# EAGLE design MCP73837_LiPo_Charger (EAGLE 9.6.2)
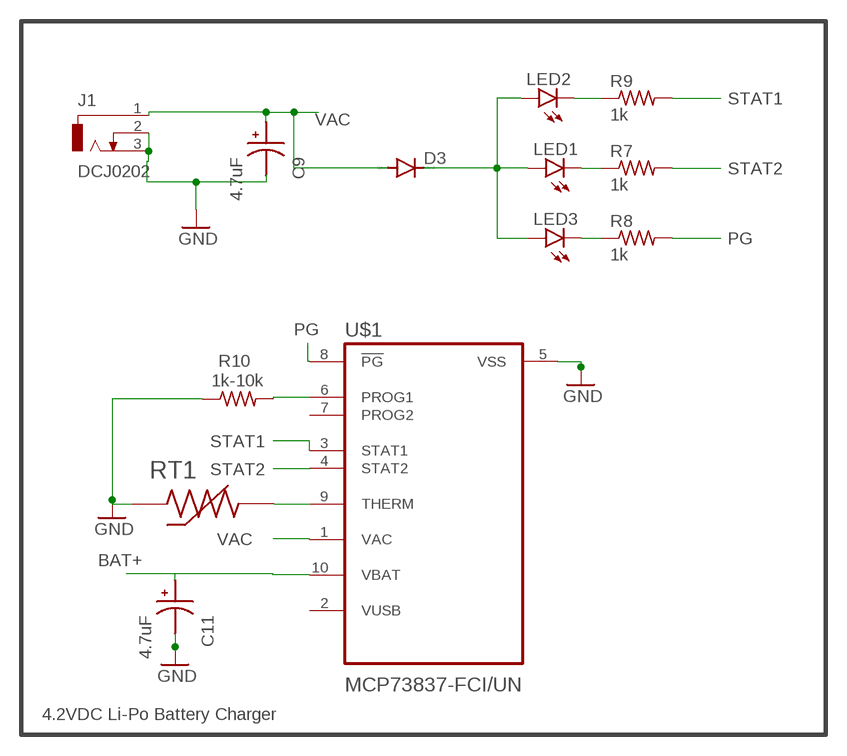
[diagram p0: schematic, sheet 1]

## Parts
C9  4.7uF  EEE-1CA100SR  [CAPAE430X550N]
C11  4.7uF  EEE-1CA100SR  [CAPAE430X550N]
D3  DIODE-DO214BA  [DO214BA]
J1  DCJ0202  [DCJ0202]
LED1  LEDCHIP-LED0805  [CHIP-LED0805]
LED2  LEDCHIP-LED0805  [CHIP-LED0805]
LED3  LEDCHIP-LED0805  [CHIP-LED0805]
R7  1k  RP73PF2A10KBTDF  [RESC2012X65N]
R8  1k  RP73PF2A10KBTDF  [RESC2012X65N]
R9  1k  RP73PF2A10KBTDF  [RESC2012X65N]
R10  1k-10k  RP73PF2A10KBTDF  [RESC2012X65N]
RT1  NCP18XW223E03RB  [THRMC1608X95N]
U$1  MCP73837-FCI/UN  [SOP50P490X110-10N]

## Nets
BAT+: C11.1 U$1.10(VBAT)
GND: C9.2 C11.2 J1.2 J1.3 R10.1 RT1.1 U$1.5(VSS)
N$18: D3.C LED1.A LED2.A LED3.A
N$19: LED2.C R9.1
N$20: LED1.C R7.1
N$21: LED3.C R8.1
N$23: R10.2 U$1.6(PROG1)
N$24: RT1.2 U$1.9(THERM)
PG: R8.2 U$1.8(!PG)
STAT1: R9.2 U$1.3(STAT1)
STAT2: R7.2 U$1.4(STAT2)
VAC: C9.1 D3.A J1.1 U$1.1(VAC)
Unconnected: U$1.2(VUSB) U$1.7(PROG2)

## Notes on the sheet
- 4.2VDC Li-Po Battery Charger

## Library data of the parts
C9 C11 = EEE-1CA100SR_10uF_SMD:EEE-1CA100SR: Capacitor Alum Elec, 10uf, 16v, 20%, Scapacitor Alum Elec, 10uf, 16v, 20%, Smd, Full Reel Check prices <https://pricing.snapeda.com/search/part/EEE-1CA100SR/?ref=eda>; AVAILABILITY: Warning; DESCRIPTION: 10µF 16V Aluminum Electrolytic Capacitors Radial, Can - SMD 2000 Hrs @ 85°C; MF: Panasonic; MP: EEE-1CA100SR; PACKAGE: RADIAL Panasonic Electronic Components; PRICE: None; PURCHASE-URL: https://pricing.snapeda.com/search/part/EEE-1CA100SR/?ref=eda
D3 = diode:DIODE-: DIODE
J1 = con-jack:DCJ0202: DC POWER JACK Source: DCJ0202.pdf; OC_FARNELL: unknown; OC_NEWARK: unknown
LED1-LED3 = led:LED: LED OSRAM: - CHIPLED LG R971, LG N971, LY N971, LG Q971, LY Q971, LO R971, LY R971 LH N974, LH R974 LS Q976, LO Q976, LY Q976 LO Q996 - Hyper CHIPLED LW Q18S LB Q993, LB Q99A, LB R99A - SideLED LS A670, LO A670, LY A670, LG A670, LP A670 LB A673, LV A673, LT A673, LW A673 LH A674 LY A675 LS A676, LA A676, LO A676, LY A676, LW A676 LS A679, LY A679, LG A679 - Hyper Micro SIDELED® LS Y876, LA Y876, LO Y876, LY Y876 LT Y87S - SmartLED LW L88C, LW L88S LB L89C, LB L89S, LG L890 LS L89K, LO L89K, LY L89K LS L896, LA L896, LO L896, LY L896 - TOPLED LS T670, LO T670, LY T670, LG T670, LP T670 LSG T670, LSP T670, LSY T670, LOP T670, LYG T670 LG T671, LOG T671, LSG T671 LB T673, LV T673, LT T673, LW T673 LH T674 LS T676, LA T676, LO T676, LY T676, LB T676, LH T676, LSB T676, LW T676 LB T67C, LV T67C, LT T67C, LS T67K, LO T67K, LY T67K, LW E67C LS E67B, LA E67B, LO E67B, LY E67B, LB E67C, LV E67C, LT E67C LW T67C LS T679, LY T679, LG T679 LS T770, LO T770, LY T770, LG T770, LP T770 LB T773, LV T773, LT T773, LW T773 LH T774 LS E675, LA E675, LY E675, LS T675 LS T776, LA T776, LO T776, LY T776, LB T776 LHGB T686 LT T68C, LB T68C - Hyper Mini TOPLED® LB M676 - Mini TOPLED Santana® LG M470 LS M47K, LO M47K, LY M47K Source: http://www.osram.convergy.de LUXEON: - LUMILED® LXK2-PW12-R00, LXK2-PW12-S00, LXK2-PW14-U00, LXK2-PW14-V00 LXK2-PM12-R00, LXK2-PM12-S00, LXK2-PM14-U00 LXK2-PE12-Q00, LXK2-PE12-R00, LXK2-PE12-S00, LXK2-PE14-T00, LXK2-PE14-U00 LXK2-PB12-K00, LXK2-PB12-L00, LXK2-PB12-M00, LXK2-PB14-N00, LXK2-PB14-P00, LXK2-PB14-Q00 LXK2-PR12-L00, LXK2-PR12-M00, LXK2-PR14-Q00, LXK2-PR14-R00 LXK2-PD12-Q00, LXK2-PD12-R00, LXK2-PD12-S00 LXK2-PH12-R00, LXK2-PH12-S00 LXK2-PL12-P00, LXK2-PL12-Q00, LXK2-PL12-R00 Source: www.luxeon.com KINGBRIGHT: KA-3528ASYC Source: www.kingbright.com
R7-R10 = SMD_Res_10k:RP73PF2A10KBTDF: RES, THIN FILM, 10K, 0.1%, 0.25W, 0805 Check prices <https://pricing.snapeda.com/search/part/RP73PF2A10KBTDF/?ref=eda>; AVAILABILITY: Warning; DESCRIPTION: 10 kOhms ±0.1% 0.25W, 1/4W Chip Resistor 0805 (2012 Metric) Thin Film; MF: TE Connectivity; MP: RP73PF2A10KBTDF; PACKAGE: 0805 TE Connectivity; PRICE: None; PURCHASE-URL: https://pricing.snapeda.com/search/part/RP73PF2A10KBTDF/?ref=eda
RT1 = Thermistor_22k_0603:NCP18XW223E03RB: Thermistor NTC 22K Ohm 3% 2-Pin 0603 Surface Mount Solder Pad 3987K T/R Check prices <https://pricing.snapeda.com/search/part/NCP18XW223E03RB/?ref=eda>; AVAILABILITY: Good; DESCRIPTION: Thermistor NTC 22K Ohm 3% 2-Pin 0603 Surface Mount Solder Pad 3987K T/R; MF: Murata; MP: NCP18XW223E03RB; PACKAGE: 1608 Murata; PRICE: None; PURCHASE-URL: https://pricing.snapeda.com/search/part/NCP18XW223E03RB/?ref=eda
U$1 = MCP73837-FCI_UN:MCP73837-FCI/UN: Check prices <https://pricing.snapeda.com/search/part/MCP73837-FCI/UN/?ref=eda>; AVAILABILITY: Warning; DESCRIPTION: Charger IC Lithium Ion/Polymer 10-MSOP; MF: Microchip; MP: MCP73837-FCI/UN; PACKAGE: MSOP-10 Microchip; PRICE: None; PURCHASE-URL: https://pricing.snapeda.com/search/part/MCP73837-FCI/UN/?ref=eda

## Board
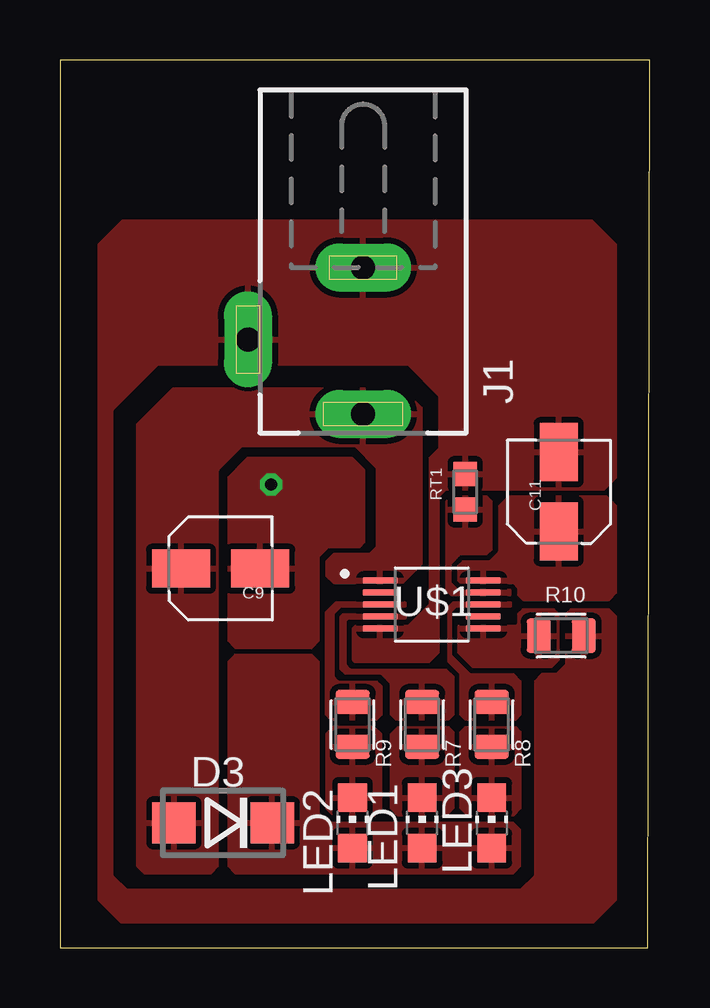
[diagram p1: board, top side]
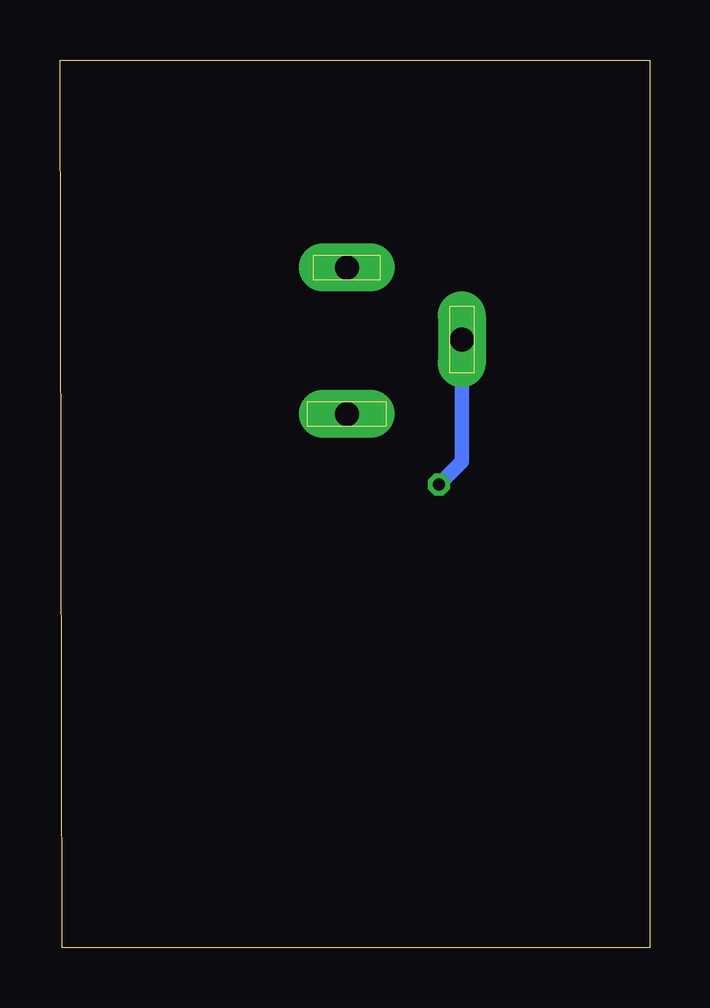
[diagram p2: board, bottom side, seen from below]

Size 24.6 x 37 mm. Coordinates in mm from the lower left corner, seen from the top.
Outline: 0,0 24.5,0 24.6,37 0,37 0,0
Copper layers (1*16): Top 0.035mm / dielectric 1.5mm / Bottom 0.035mm
Design rules "default": minimum track width 6mil, minimum drill 0.35mm, track to track 6mil, track to pad 6mil, pad to pad 6mil, via to via 6mil, smd to smd 6mil, copper to edge 40mil, drill to drill 6mil, minimum pad ring 10mil, minimum via ring 8mil, stop-mask expansion 4mil, vias tented up to drill 0mil, thermal gap 10mil

### Footprints (pad centres in the part's own frame; a part is rotated, then mirrored left to right if it is on the bottom)
CAPAE430X550N = smd 2.42 x 1.58: 1 -1.65,0; 2 1.65,0
DO214BA = smd 1.8 x 1.7: A 2.05,0; C -2.05,0
DCJ0202 = drill 1 pad 2 long: 1 0,3.1; 2 4.8,0; 3 0,-3
CHIP-LED0805 = smd 1.2 x 1.2: A 0,-1.05; C 0,1.05
RESC2012X65N = smd 1 x 1.42: 1 -0.935,0; 2 0.935,0
THRMC1608X95N = smd 1 x 0.97: 1 -0.735,0; 2 0.735,0
SOP50P490X110-10N = smd 1.47 x 0.28: 1 -2.15,1; 2 -2.15,0.5; 3 -2.15,0; 4 -2.15,-0.5; 5 -2.15,-1; 6 2.15,-1; 7 2.15,-0.5; 8 2.15,0; 9 2.15,0.5; 10 2.15,1

### Placement (x,y rotation side)
C9  6.7,15.8 0 top
C11  20.8,19 90 top
D3  6.8,5.2 180 top
J1  12.64,25.35 180 top
LED1  15.1,5.2 0 top
LED2  12.2,5.2 0 top
LED3  18,5.2 0 top
R7  15.1,9.3 90 top
R8  18,9.3 90 top
R9  12.2,9.3 90 top
R10  20.9,13 180 top
RT1  16.9,19 270 top
U$1  15.5,14.3 0 top

### Tracks (layer width: path | path; a pad name or v marks a point on that pad's centre or on a via)
BAT+
  pour Top: 16.7,15.2 18.9,15.2 19.1,15 19.1,14.7 19.3,14.5 22.9,14.5 23.2,14.8 23.2,18.4 22.8,18.8 18.7,18.8 18.3,18.4 18.3,16.5 17.9,16.1 16.8,16.1 16.6,15.9 16.6,15.3
GND  (via drill 0.5 pad 0.9)
  Bottom 0.61: v8.8,19.3 7.84,20.26 J1.2
  pour Top: 12.5,16.7 12.7,16.9 12.7,19.9 12.2,20.4 7.8,20.4 7,19.6 7,12.8 7.3,12.5 10.5,12.5 10.8,12.8 10.8,16.3 11.2,16.7
  pour Top: 14.5,13.4 12.3,13.4 12.2,13.3 12.2,12 12.3,11.9 15.4,11.9 15.8,12.3 15.8,18.8 16.1,19.1 22.7,19.1 23.2,19.6 23.2,29.3 22.2,30.3 2.6,30.3 1.6,29.3 1.6,2 2.6,1 22.2,1 23.2,2 23.2,13.8 22.9,14.1 21.3,14.1 21.1,13.9 21.1,11.8 20.7,11.4 20.1,11.4 19.8,11.1 19.8,3 19.2,2.4 2.8,2.4 2.2,3 2.2,22.4 4.1,24.3 14.5,24.3 15.8,23 15.8,20.8 15.4,20.4 15.4,14.3
N$18
  pour Top: 7,11.9 7,3.4 7.3,3.1 18.9,3.1 19.2,3.4 19.2,4.9 18.9,5.2 11.2,5.2 10.8,5.6 10.8,11.9 10.5,12.2 7.3,12.2
N$19
  pour Top: 11.1,8.9 11.1,5.8 11.4,5.5 13.1,5.5 13.4,5.8 13.4,8.9 13.1,9.2 11.4,9.2
N$20
  pour Top: 13.8,8.9 14.1,9.2 16.2,9.2 16.4,9 16.4,5.8 16.1,5.5 14.1,5.5 13.8,5.8
N$21
  pour Top: 16.7,9 16.9,9.2 19,9.2 19.2,9 19.2,5.8 18.9,5.5 17,5.5 16.7,5.8
N$23
  pour Top: 16.6,13.4 16.6,12.3 17.2,11.7 20.5,11.7 20.8,12 20.8,13.9 20.6,14.1 19.3,14.1 19.1,13.9 19.1,13.5 19,13.4
N$24
  pour Top: 16.1,18.6 16.1,14.9 16.3,14.7 18.8,14.7 18.8,14.9 16.6,14.9 16.3,15.2 16.3,16 16.7,16.4 17.8,16.4 18,16.6 18,18.6 17.8,18.8 16.3,18.8
PG
  pour Top: 16.7,9.7 16.7,11.4 16.2,11.9 16.2,14.2 16.4,14.4 18.8,14.4 18.8,14.2 16.5,14.2 16.3,14 16.3,12.2 17.1,11.4 18.9,11.4 19.2,11.1 19.2,9.7 19,9.5 16.9,9.5
STAT1
  pour Top: 13.2,9.5 11.3,9.5 11.1,9.7 11.1,14 11.5,14.4 14.4,14.4 14.4,14.2 11.7,14.2 11.4,13.9 11.4,11.3 11.6,11.1 13.2,11.1 13.4,10.9 13.4,9.7
STAT2
  pour Top: 14,9.5 13.8,9.7 13.8,11 13.4,11.4 11.9,11.4 11.7,11.6 11.7,13.8 11.8,13.9 14.4,13.9 14.4,13.7 12,13.7 11.9,13.6 11.9,11.8 12.1,11.6 16.1,11.6 16.4,11.3 16.4,9.7 16.2,9.5
VAC
  pour Top: 6.6,3.4 6.6,19.9 7.6,20.9 12.3,20.9 13.2,20 13.2,16.7 12.9,16.4 11.4,16.4 11.1,16.1 11.1,15.5 11.4,15.2 14.3,15.2 15.1,16 15.1,22.5 14.3,23.3 4.7,23.3 3.2,21.8 3.2,3.4 3.5,3.1 6.3,3.1